# Altium schematic sheet 电机码盘.SchDoc
size A4
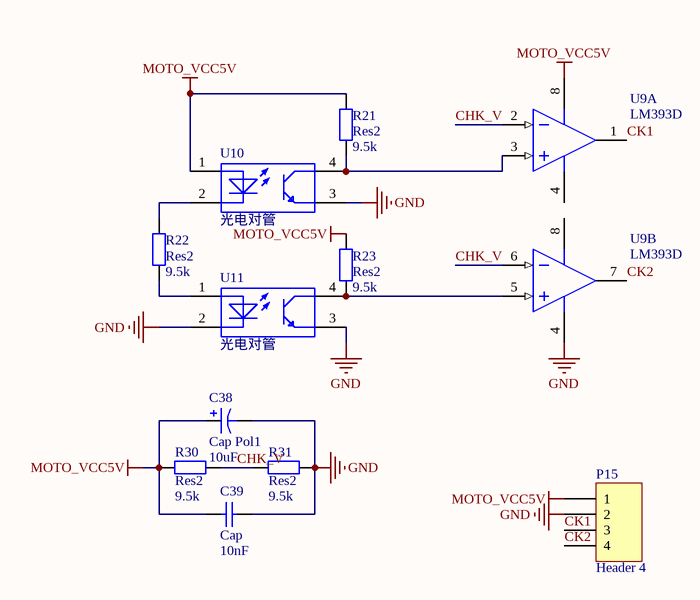
[diagram p0: 电机码盘.SchDoc]

## Parts
C38  Cap Pol1  value 10uF  [LC-1210_C]
C39  Cap  value 10nF  [LC-0603_C]
P15  Header 4  [HDR1X4]
R21  Res2  value 9.5k  [LC-0603_R]
R22  Res2  value 9.5k  [LC-0603_R]
R23  Res2  value 9.5k  [LC-0603_R]
R30  Res2  value 9.5k  [LC-0603_R]
R31  Res2  value 9.5k  [LC-0603_R]
U9  LM393D  [SO8_N]  (parts A,B of 2)
U10  光电对管  [马达光电对管]
U11  光电对管  [马达光电对管]

## Nets
GND: C38.2 C39.2 P15.2 R31.2 U9.4(V-) U10.3 U11.2 U11.3
MOTO_VCC5V: C38.1 C39.1 P15.1 R21.1 R23.1 R30.1 U9.8(V+) U10.1
CHK_V: R30.2 R31.1 U9.2(IN-) U9.6(IN-)
CK1: P15.3 U9.1(OUT)
CK2: P15.4 U9.7(OUT)
NetR21_2: R21.2 U9.3(IN+) U10.4
NetR22_1: R22.1 U10.2
NetR22_2: R22.2 U11.1
NetR23_2: R23.2 U9.5(IN+) U11.4

## Library data of the parts
C38 = Cap Pol1: Polarized Capacitor (Radial); Published: 8-Jun-2000; LatestRevisionDate: 17-Jul-2002; LatestRevisionNote: Re-released for DXP Platform.; PackageReference: RB7.6-15; Publisher: Altium Limited
C39 = Cap: Capacitor; Published: 8-Jun-2000; LatestRevisionDate: 17-Jul-2002; LatestRevisionNote: Re-released for DXP Platform.; PackageReference: RAD-0.3; Publisher: Altium Limited
P15 = Header 4: Header, 4-Pin; LatestRevisionDate: 17-Jul-2002; LatestRevisionNote: Re-released for DXP Platform.; Publisher: Altium Limited
R21-R23 R30 R31 = Res2: Resistor; Published: 8-Jun-2000; LatestRevisionDate: 17-Jul-2002; LatestRevisionNote: Re-released for DXP Platform.; PackageReference: AXIAL-0.4; Publisher: Altium Limited
U9 = LM393D: Low-Power Dual Voltage Comparator; Published: 24-Aug-2001; LatestRevisionDate: 13-Apr-2006; LatestRevisionNote: IPC-7351 Footprint Added.; DatasheetVersion: Jun-1998; PackageVersion: Dec-2002; PackageReference: SO8; Publisher: Altium Limited; PackageDescription: 8-Pin Small Outline Integrated Circuit 1.27 mm Pitch; Code_JEDEC: MS-012-AA; Code_IPC: SOIC127P600-8; ComponentLink1Description: Manufacturer Link; ComponentLink1URL: http://www.st.com/; ComponentLink2Description: Datasheet; ComponentLink2URL: http://www.st.com/stonline/products/literature/ds/2164/lm293.pdf